# EAGLE design telemetry_controller (EAGLE 5.06)
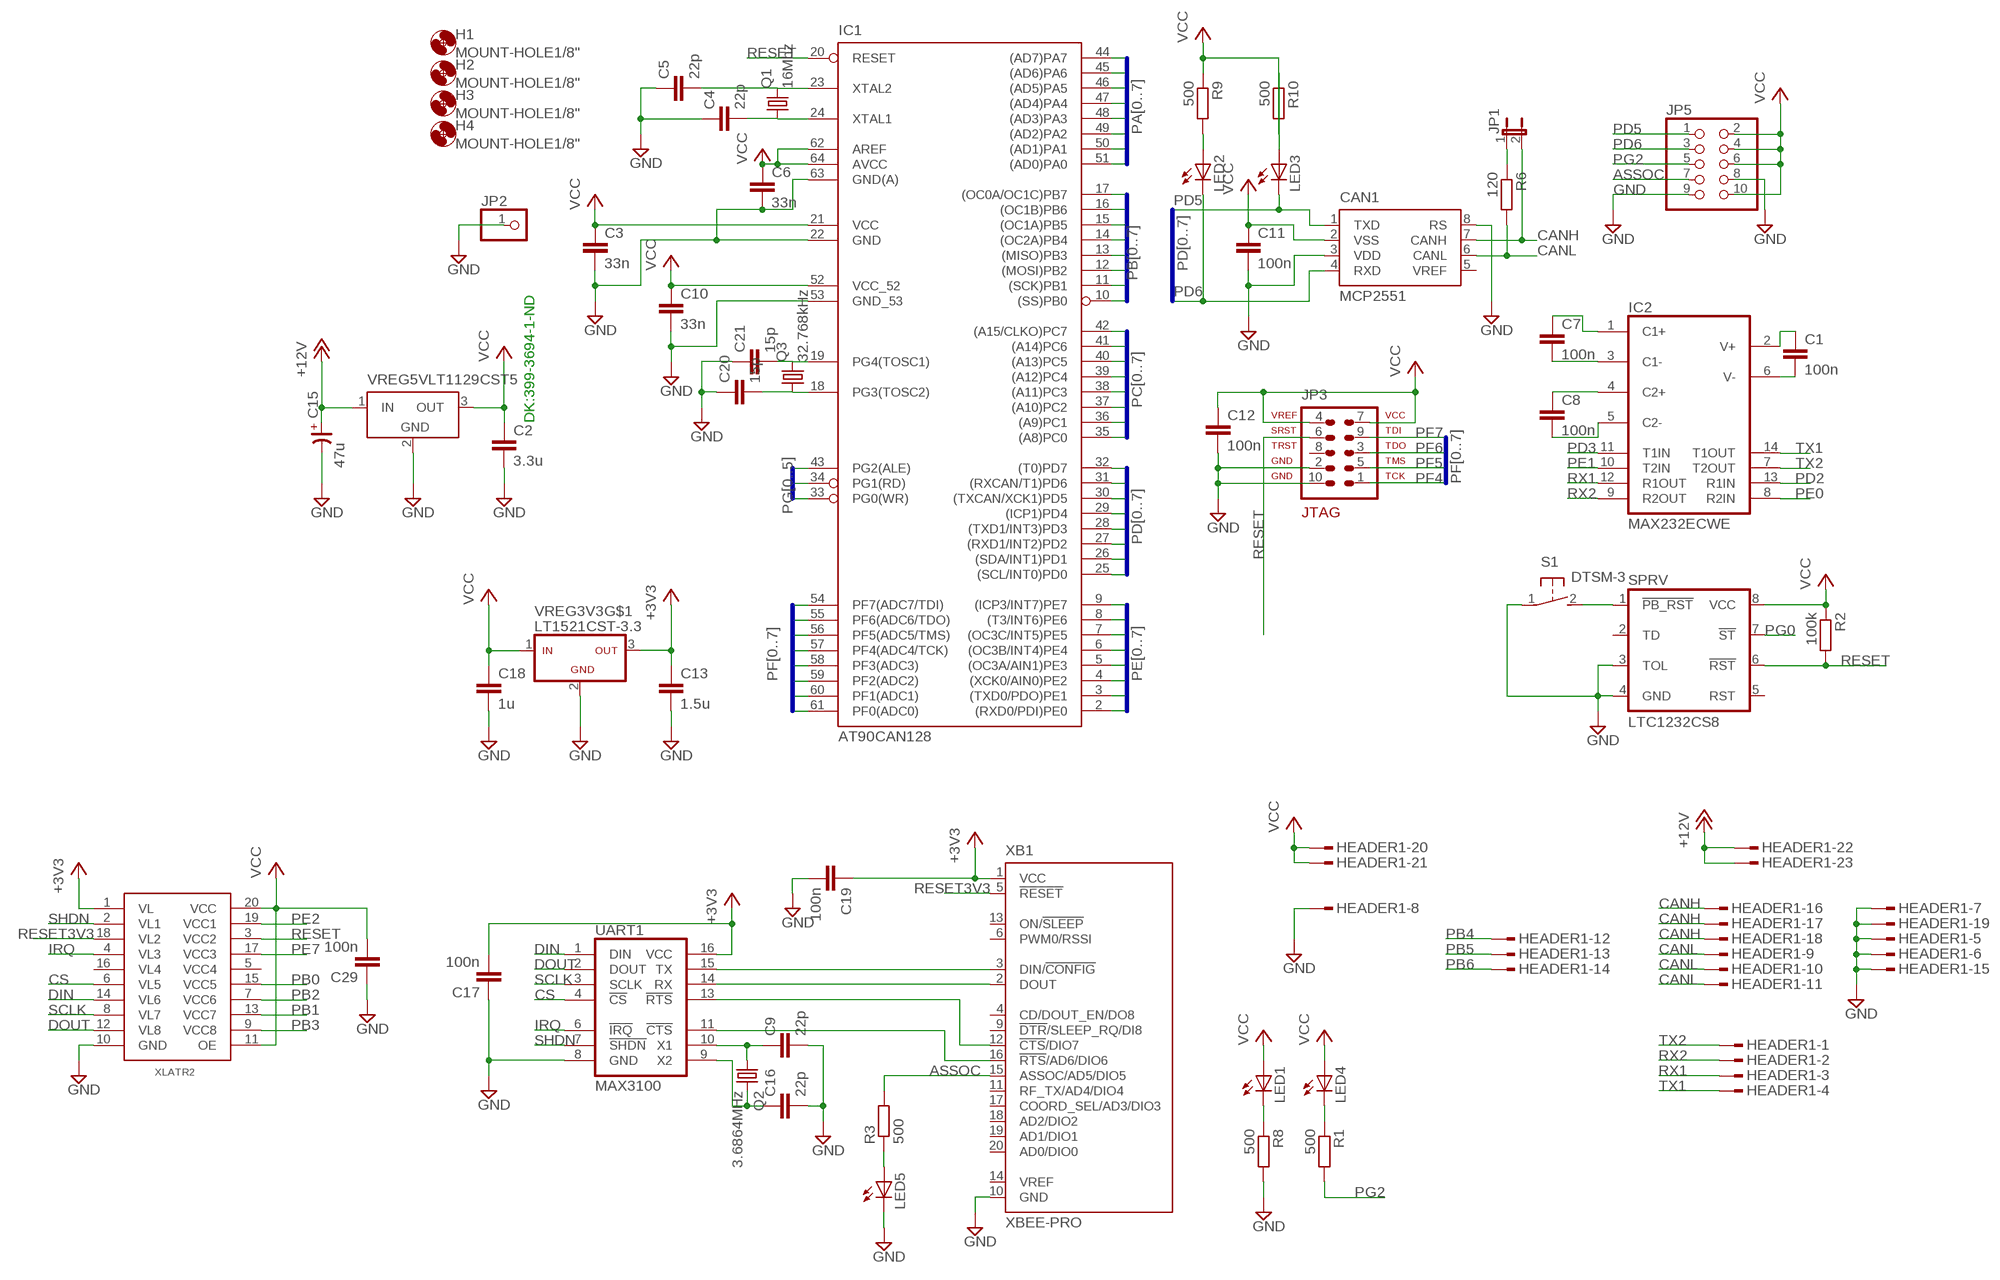
[diagram p0: schematic, sheet 1]

## Parts
C1  100n  C-EUC1206  [C1206]
C2  3.3u  C-EUC1206  [C1206]
C3  33n  C-EUC1206  [C1206]
C4  22p  C-EUC1206  [C1206]
C5  22p  C-EUC1206  [C1206]
C6  33n  C-EUC1206  [C1206]
C7  100n  C-EUC1206  [C1206]
C8  100n  C-EUC1206  [C1206]
C9  22p  C-EUC1206  [C1206]
C10  33n  C-EUC1206  [C1206]
C11  100n  C-EUC1206  [C1206]
C12  100n  C-EUC1206  [C1206]
C13  1.5u  C-EUC1206  [C1206]
C15  47u  CP-SV-E/F  [SV-E/F]
C16  22p  C-EUC1206  [C1206]
C17  100n  C-EUC1206  [C1206]
C18  1u  C-EUC1206  [C1206]
C19  100n  C-EUC1206  [C1206]
C20  15p  C-EUC1206  [C1206]
C21  15p  C-EUC1206  [C1206]
C29  100n  C-EUC1206  [C1206]
CAN1  MCP2551  [SOIC8]
H1  MOUNT-HOLE1/8"  [1/8"]
H2  MOUNT-HOLE1/8"  [1/8"]
H3  MOUNT-HOLE1/8"  [1/8"]
H4  MOUNT-HOLE1/8"  [1/8"]
HEADER1  AMPSEAL23-HEADER  [AMPSEAL23-HEADER]
IC1  AT90CAN128  [TQFP64]
IC2  MAX232ECWE  [SO16L]
JP1  JP1E  [JP1]
JP2  PINHD-1X1  [1X01]
JP3  AVR-JTAG-10  [AVR-JTAG-10]
JP5  PINHD-2X5  [2X05]
LED1  LEDCHIPLED_1206  [CHIPLED_1206]
LED2  LEDCHIPLED_1206  [CHIPLED_1206]
LED3  LEDCHIPLED_1206  [CHIPLED_1206]
LED4  LEDCHIPLED_1206  [CHIPLED_1206]
LED5  LEDCHIPLED_1206  [CHIPLED_1206]
Q1  16Mhz  CRYSTALHC49UP  [HC49UP]
Q2  3.6864MHz  CRYSTALHC49UP  [HC49UP]
Q3  32.768kHz  CRYSTALTC26H  [TC26H]
R1  500  R-EU_R1206  [R1206]
R2  100k  R-EU_R1206  [R1206]
R3  500  R-EU_R1206  [R1206]
R6  120  R-EU_R1206  [R1206]
R8  500  R-EU_R1206  [R1206]
R9  500  R-EU_R1206  [R1206]
R10  500  R-EU_R1206  [R1206]
S1  DTSM-3  [DTSM-3]
SPRV  LTC1232CS8  [SOIC8]
UART1  MAX3100  [QSOP16]
VREG3V3  LT1521CST-3.3  [SOT223]
VREG5V  LT1129CST5  [SOT223]
XB1  XBEE-PRO  [XBEE-PRO]
XLATR2  ST2378E  [TSSOP20]

## Nets
+3V3: C13.1 C17.2 C19.1 UART1.16(VCC) VREG3V3.3(OUT) XB1.1(VCC) XLATR2.1(VL)
+12V: C15.+ HEADER1.22 HEADER1.23 VREG5V.1(IN)
ASSOC: JP5.7 R3.2 XB1.15(ASSOC/AD5/DIO5)
CANH: CAN1.7(CANH) HEADER1.16 HEADER1.17 HEADER1.18 JP1.2
CANL: CAN1.6(CANL) HEADER1.9 HEADER1.10 HEADER1.11 R6.2
CS: UART1.4(!CS) XLATR2.6(VL5)
DIN: UART1.1(DIN) XLATR2.14(VL6)
DOUT: UART1.2(DOUT) XLATR2.12(VL8)
GND: C2.2 C3.2 C4.1 C5.1 C6.2 C9.2 C10.2 C11.2 C12.2 C13.2 C15.- C16.2 C17.1 C18.2 C19.2 C20.1 C21.1 C29.1 CAN1.3(VDD) CAN1.8(RS) HEADER1.5 HEADER1.6 HEADER1.7 HEADER1.8 HEADER1.15 HEADER1.19 IC1.22(GND) IC1.53(GND_53) IC1.63(GND(A)) JP2.1 JP3.2 JP3.10 JP5.8 JP5.9 LED5.C R8.2 S1.1 SPRV.3(TOL) SPRV.4(GND) UART1.8(GND) VREG3V3.2(GND) VREG5V.2(GND) XB1.10(GND) XLATR2.10(GND)
IRQ: UART1.6(!IRQ) XLATR2.4(VL3)
N$1: LED4.C R1.1
N$2: C1.2 IC2.6(V-)
N$3: C1.1 IC2.2(V+)
N$4: C5.2 IC1.23(XTAL2) Q1.2
N$5: C4.2 IC1.24(XTAL1) Q1.1
N$6: C7.1 IC2.1(C1+)
N$7: C7.2 IC2.3(C1-)
N$8: C8.1 IC2.4(C2+)
N$9: C8.2 IC2.5(C2-)
N$10: C9.1 Q2.1 UART1.10(X1)
N$11: LED5.A R3.1
N$12: UART1.11(!CTS) XB1.16(!RTS!/AD6/DIO6)
N$13: C16.1 Q2.2 UART1.9(X2)
N$14: UART1.15(TX) XB1.3(DIN/!CONFIG)
N$15: UART1.14(RX) XB1.2(DOUT)
N$16: UART1.13(!RTS) XB1.12(!CTS!/DIO7)
N$18: S1.2 SPRV.1(!PB_RST)
N$19: JP1.1 R6.1
N$20: LED1.C R8.1
N$21: LED2.A R9.2
N$23: LED3.A R10.1
PA0: IC1.51((AD0)PA0)
PA1: IC1.50((AD1)PA1)
PA2: IC1.49((AD2)PA2)
PA3: IC1.48((AD3)PA3)
PA4: IC1.47((AD4)PA4)
PA5: IC1.46((AD5)PA5)
PA6: IC1.45((AD6)PA6)
PA7: IC1.44((AD7)PA7)
PB0: IC1.10((SS)PB0) XLATR2.15(VCC5)
PB1: IC1.11((SCK)PB1) XLATR2.13(VCC7)
PB2: IC1.12((MOSI)PB2) XLATR2.7(VCC6)
PB3: IC1.13((MISO)PB3) XLATR2.9(VCC8)
PB4: HEADER1.12 IC1.14((OC2A)PB4)
PB5: HEADER1.13 IC1.15((OC1A)PB5)
PB6: HEADER1.14 IC1.16((OC1B)PB6)
PB7: IC1.17((OC0A/OC1C)PB7)
PC0: IC1.35((A8)PC0)
PC1: IC1.36((A9)PC1)
PC2: IC1.37((A10)PC2)
PC3: IC1.38((A11)PC3)
PC4: IC1.39((A12)PC4)
PC5: IC1.40((A13)PC5)
PC6: IC1.41((A14)PC6)
PC7: IC1.42((A15/CLKO)PC7)
PD0: IC1.25((SCL/INT0)PD0)
PD1: IC1.26((SDA/INT1)PD1)
PD2: IC1.27((RXD1/INT2)PD2) IC2.13(R1IN)
PD3: IC1.28((TXD1/INT3)PD3) IC2.11(T1IN)
PD4: IC1.29((ICP1)PD4)
PD5: CAN1.1(TXD) IC1.30((TXCAN/XCK1)PD5) JP5.1 LED3.C
PD6: CAN1.4(RXD) IC1.31((RXCAN/T1)PD6) JP5.3 LED2.C
PD7: IC1.32((T0)PD7)
PE0: IC1.2((RXD0/PDI)PE0) IC2.8(R2IN)
PE1: IC1.3((TXD0/PDO)PE1) IC2.10(T2IN)
PE2: IC1.4((XCK0/AIN0)PE2) XLATR2.19(VCC1)
PE3: IC1.5((OC3A/AIN1)PE3)
PE4: IC1.6((OC3B/INT4)PE4)
PE5: IC1.7((OC3C/INT5)PE5)
PE6: IC1.8((T3/INT6)PE6)
PE7: IC1.9((ICP3/INT7)PE7) XLATR2.17(VCC3)
PF0: IC1.61(PF0(ADC0))
PF1: IC1.60(PF1(ADC1))
PF2: IC1.59(PF2(ADC2))
PF3: IC1.58(PF3(ADC3))
PF4: IC1.57(PF4(ADC4/TCK)) JP3.1
PF5: IC1.56(PF5(ADC5/TMS)) JP3.5
PF6: IC1.55(PF6(ADC6/TDO)) JP3.3
PF7: IC1.54(PF7(ADC7/TDI)) JP3.9
PG0: IC1.33(PG0(WR)) SPRV.7(!ST)
PG1: IC1.34(PG1(RD))
PG2: IC1.43(PG2(ALE)) JP5.5 R1.2
PG3: C20.2 IC1.18(PG3(TOSC2)) Q3.1
PG4: C21.2 IC1.19(PG4(TOSC1)) Q3.2
RESET: IC1.20(RESET) JP3.6 R2.2 SPRV.6(!RST) XLATR2.3(VCC2)
RESET3V3: XB1.5(!RESET) XLATR2.18(VL2)
RX1: HEADER1.3 IC2.12(R1OUT)
RX2: HEADER1.2 IC2.9(R2OUT)
SCLK: UART1.3(SCLK) XLATR2.8(VL7)
SHDN: UART1.7(!SHDN) XLATR2.2(VL1)
TX1: HEADER1.4 IC2.14(T1OUT)
TX2: HEADER1.1 IC2.7(T2OUT)
VCC: C2.1 C3.1 C6.1 C10.1 C11.1 C12.1 C18.1 C29.2 CAN1.2(VSS) HEADER1.20 HEADER1.21 IC1.21(VCC) IC1.52(VCC_52) IC1.62(AREF) IC1.64(AVCC) JP3.4 JP3.7 JP5.2 JP5.4 JP5.6 JP5.10 LED1.A LED4.A R2.1 R9.1 R10.2 SPRV.8(VCC) VREG3V3.1(IN) VREG5V.3(OUT) XLATR2.11(OE) XLATR2.20(VCC)
Unconnected: JP3.8 SPRV.2(TD) SPRV.5(RST) XB1.4(CD/DOUT_EN/DO8) XB1.6(PWM0/RSSI) XB1.9(!DTR!/SLEEP_RQ/DI8) XB1.11(RF_TX/AD4/DIO4) XB1.13(ON/!SLEEP) XB1.14(VREF) XB1.17(COORD_SEL/AD3/DIO3) XB1.18(AD2/DIO2) XB1.19(AD1/DIO1) XB1.20(AD0/DIO0) XLATR2.5(VCC4) XLATR2.16(VL4)

## Buses
PD[0..7]
PF[0..7]
PE[0..7]
PB[0..7]
PA[0..7]
PC[0..7]
PG[0..5]

## Notes on the sheet
- DK:399-3694-1-ND

## Power pins joined to a net without a drawn wire
GND: IC2.15(GND) VREG3V3.4(GND) VREG5V.4(GND)
VCC: IC2.16(VCC)
VREF: CAN1.5(VREF)

## Library data of the parts
C1-C13 C16-C21 C29 = resistor:C-EU: CAPACITOR, European symbol
C15 = cap-master:CP-: POLARIZED CAP
CAN1 = MCP2551:MCP2551
H1-H4 = holes:MOUNT-HOLE: MOUNTING HOLE with drill center marker
HEADER1 = ampseal:AMPSEAL23-HEADER: HEADER ASSEMBLY, 23 POSITION, SNAP-IN, AMPSEAL
IC1 = at90can128:AT90CAN128
IC2 = maxim:MAX232ECWE: RS232 TRANSEIVER
JP1 = jumper:JP1E: JUMPER
JP2 = pinhead:PINHD-1X1: PIN HEADER
JP3 = atmel:AVR-JTAG-10: AVR JTAG Debug/Programming Header
JP5 = pinhead:PINHD-2X5: PIN HEADER
LED1-LED5 = led:LED: LED OSRAM: - CHIPLED LG R971, LG N971, LY N971, LG Q971, LY Q971, LO R971, LY R971 LH N974, LH R974 LS Q976, LO Q976, LY Q976 LO Q996 - Hyper CHIPLED LW Q18S LB Q993, LB Q99A, LB R99A - SideLED LS A670, LO A670, LY A670, LG A670, LP A670 LB A673, LV A673, LT A673, LW A673 LH A674 LY A675 LS A676, LA A676, LO A676, LY A676, LW A676 LS A679, LY A679, LG A679 - Hyper Micro SIDELED® LS Y876, LA Y876, LO Y876, LY Y876 LT Y87S - SmartLED LW L88C, LW L88S LB L89C, LB L89S, LG L890 LS L89K, LO L89K, LY L89K LS L896, LA L896, LO L896, LY L896 - TOPLED LS T670, LO T670, LY T670, LG T670, LP T670 LSG T670, LSP T670, LSY T670, LOP T670, LYG T670 LG T671, LOG T671, LSG T671 LB T673, LV T673, LT T673, LW T673 LH T674 LS T676, LA T676, LO T676, LY T676, LB T676, LH T676, LSB T676, LW T676 LB T67C, LV T67C, LT T67C, LS T67K, LO T67K, LY T67K, LW E67C LS E67B, LA E67B, LO E67B, LY E67B, LB E67C, LV E67C, LT E67C LW T67C LS T679, LY T679, LG T679 LS T770, LO T770, LY T770, LG T770, LP T770 LB T773, LV T773, LT T773, LW T773 LH T774 LS E675, LA E675, LY E675, LS T675 LS T776, LA T776, LO T776, LY T776, LB T776 LHGB T686 LT T68C, LB T68C - Hyper Mini TOPLED® LB M676 - Mini TOPLED Santana® LG M470 LS M47K, LO M47K, LY M47K Source: http://www.osram.convergy.de LUXEON: - LUMILED® LXK2-PW12-R00, LXK2-PW12-S00, LXK2-PW14-U00, LXK2-PW14-V00 LXK2-PM12-R00, LXK2-PM12-S00, LXK2-PM14-U00 LXK2-PE12-Q00, LXK2-PE12-R00, LXK2-PE12-S00, LXK2-PE14-T00, LXK2-PE14-U00 LXK2-PB12-K00, LXK2-PB12-L00, LXK2-PB12-M00, LXK2-PB14-N00, LXK2-PB14-P00, LXK2-PB14-Q00 LXK2-PR12-L00, LXK2-PR12-M00, LXK2-PR14-Q00, LXK2-PR14-R00 LXK2-PD12-Q00, LXK2-PD12-R00, LXK2-PD12-S00 LXK2-PH12-R00, LXK2-PH12-S00 LXK2-PL12-P00, LXK2-PL12-Q00, LXK2-PL12-R00 Source: www.luxeon.com KINGBRIGHT: KA-3528ASYC Source: www.kingbright.com
Q1-Q3 = crystal:CRYSTAL: CRYSTAL
R1-R3 R6 R8-R10 = resistor:R-EU_: RESISTOR, European symbol
S1 = switch-tact:DTSM-3
SPRV = linear:LTC1232: Microprocessor Supervisory Circuit
UART1 = maxim:MAX3100: SPI/Microwire-Compatible UART
VREG3V3 = linear-technology-2:LT1521: 300mA Low Dropout Regulators with Micropower Quiescent Current
VREG5V = linear-technology:LT1129CST5: VOLTAGE REGULATOR with shutdown
XB1 = maxstream:XBEE: XBee (TM) /XBee-PRO(TM) OEM RF Modules Source: MaxStream, Inc. xbee_productmanual.pdf
XLATR2 = stmicro_extra_lib:ST2378E

## Board
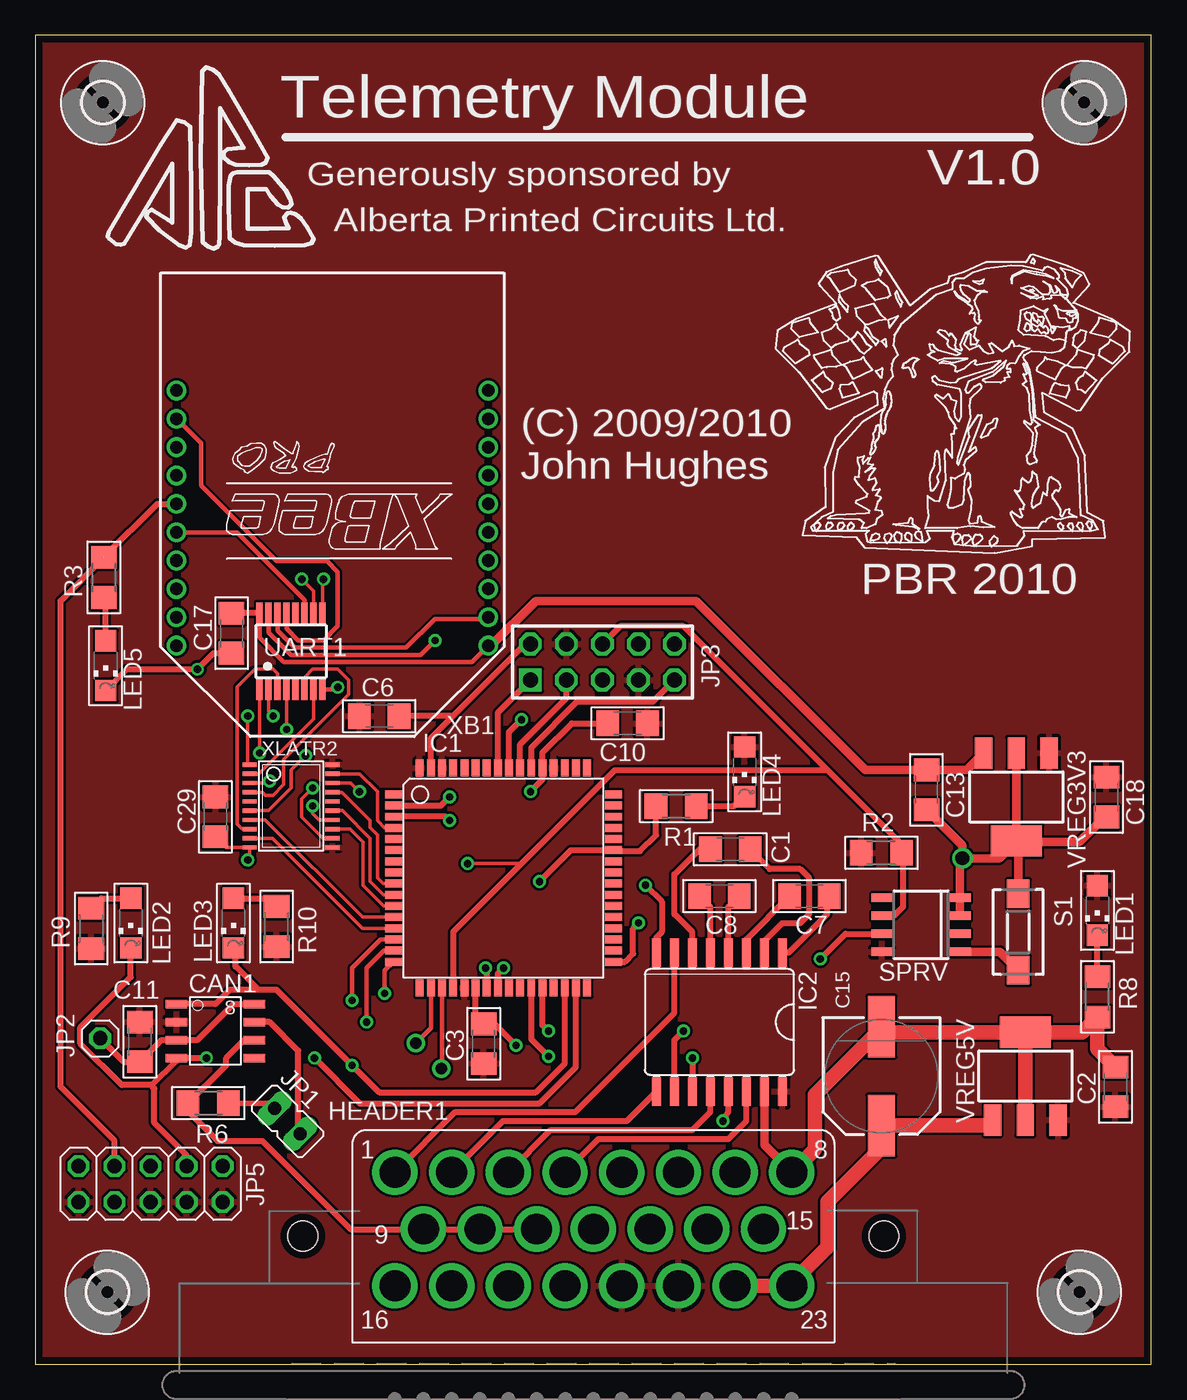
[diagram p1: board, top side]
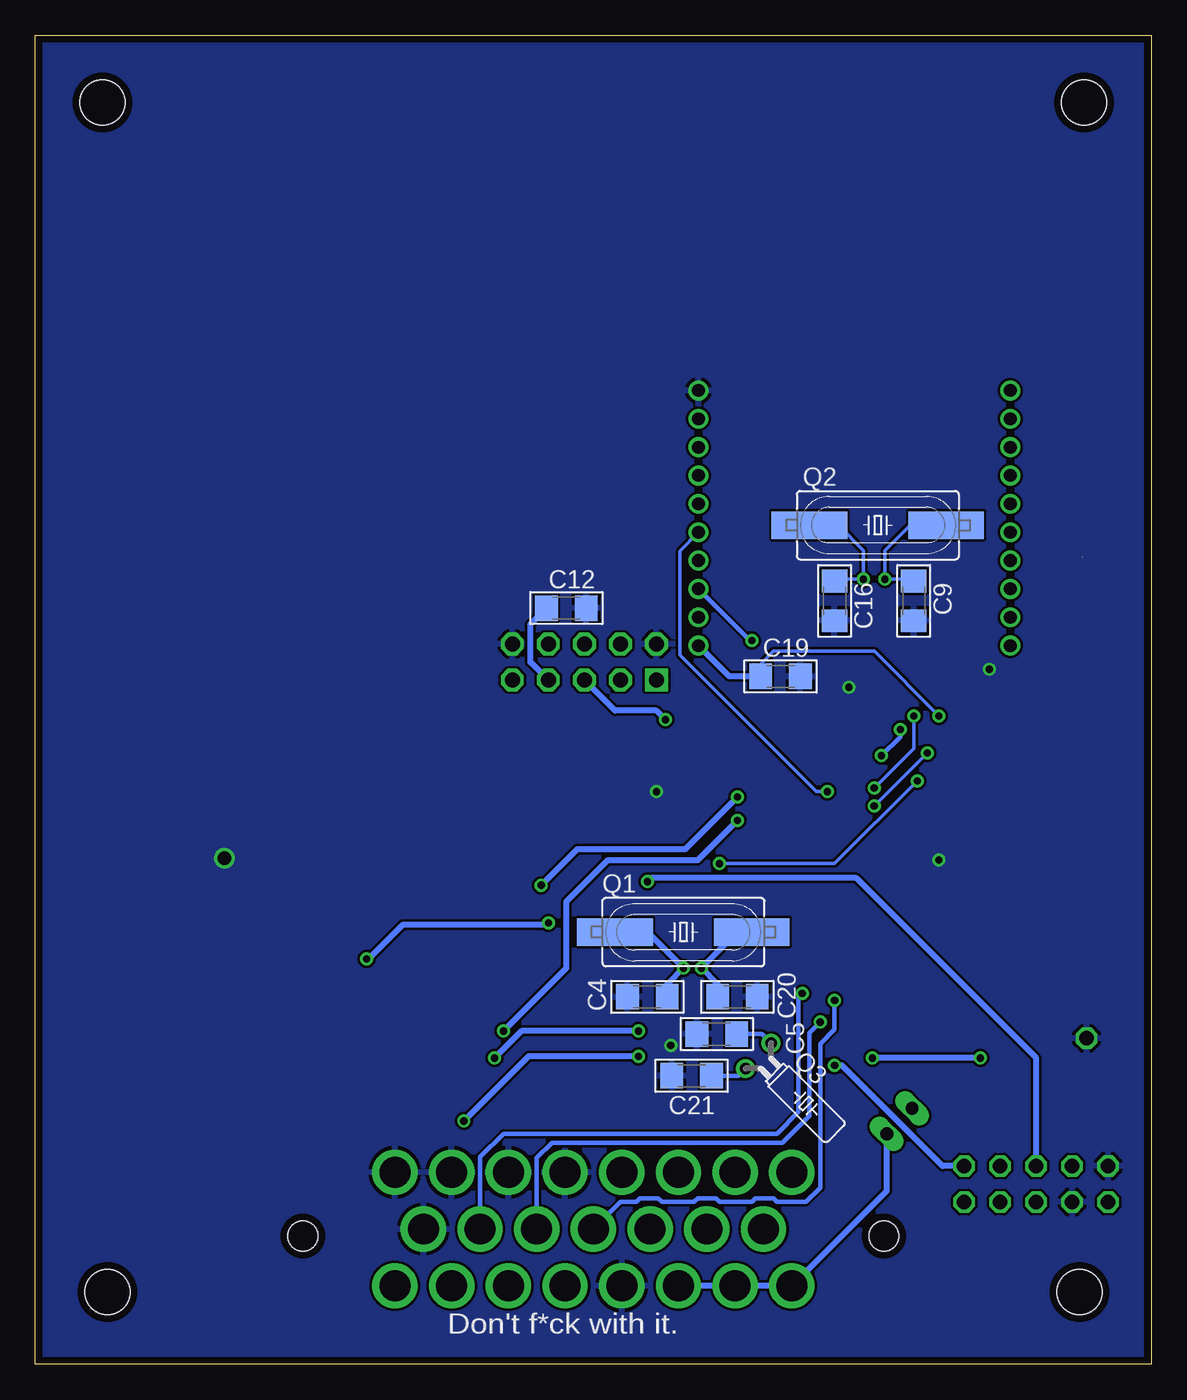
[diagram p2: board, bottom side, seen from below]

Size 78.74 x 93.74 mm. Coordinates in mm from the lower left corner, seen from the top.
Outline: 0,0 78.74,0 78.74,93.74 0,93.74 0,0
Copper layers (1*16): Top 0.035mm / dielectric 1.5mm / Bottom 0.035mm
Design rules "APCircuits": minimum track width 7mil, minimum drill 16mil, track to track 7mil, track to pad 7mil, pad to pad 7mil, via to via 7mil, smd to smd 7mil, copper to edge 20mil, drill to drill 7mil, minimum pad ring 10mil, minimum via ring 8mil, stop-mask expansion 4mil, vias tented up to drill 0mil, thermal gap 10mil

### Footprints (pad centres in the part's own frame; a part is rotated, then mirrored left to right if it is on the bottom)
C1206 = smd 1.6 x 1.8: 1 -1.4,0; 2 1.4,0
SV-E/F = smd 4.318 x 1.93: + -3.493,0; - 3.493,0
SOIC8 = smd 0.61 x 1.524: 1 -2.54,-2.743; 2 -1.27,-2.743; 3 0,-2.743; 4 1.27,-2.743; 5 1.27,2.743; 6 0,2.743; 7 -1.27,2.743; 8 -2.54,2.743
1/8" = hole 3.175: 0,0
AMPSEAL23-HEADER = drill 2.184 round: 1 -14,4; 2 -10,4; 3 -6,4; 4 -2,4; 5 2,4; 6 6,4; 7 10,4; 8 14,4; 9 -12,0; 10 -8,0; 11 -4,0; 12 0,0; 13 4,0; 14 8,0; 15 12,0; 16 -14,-4; 17 -10,-4; 18 -6,-4; 19 -2,-4; 20 2,-4; 21 6,-4; 22 10,-4; 23 14,-4 | hole 2.108: -20.5,-0.5; 20.5,-0.5
TQFP64 = smd 1.194 x 0.559: 1 -7.76,5.905; 2 -7.76,5.118; 3 -7.76,4.331; 4 -7.76,3.543; 5 -7.76,2.756; 6 -7.76,1.968; 7 -7.76,1.181; 8 -7.76,0.394; 9 -7.76,-0.394; 10 -7.76,-1.181; 11 -7.76,-1.968; 12 -7.76,-2.756; 13 -7.76,-3.543; 14 -7.76,-4.331; 15 -7.76,-5.118; 16 -7.76,-5.905; 33 7.76,-5.905; 34 7.76,-5.118; 35 7.76,-4.331; 36 7.76,-3.543; 37 7.76,-2.756; 38 7.76,-1.968; 39 7.76,-1.181; 40 7.76,-0.394; 41 7.76,0.394; 42 7.76,1.181; 43 7.76,1.968; 44 7.76,2.756; 45 7.76,3.543; 46 7.76,4.331; 47 7.76,5.118; 48 7.76,5.905 | smd 0.559 x 1.194: 17 -5.905,-7.76; 18 -5.118,-7.76; 19 -4.331,-7.76; 20 -3.543,-7.76; 21 -2.756,-7.76; 22 -1.968,-7.76; 23 -1.181,-7.76; 24 -0.394,-7.76; 25 0.394,-7.76; 26 1.181,-7.76; 27 1.968,-7.76; 28 2.756,-7.76; 29 3.543,-7.76; 30 4.331,-7.76; 31 5.118,-7.76; 32 5.905,-7.76; 49 5.905,7.76; 50 5.118,7.76; 51 4.331,7.76; 52 3.543,7.76; 53 2.756,7.76; 54 1.968,7.76; 55 1.181,7.76; 56 0.394,7.76; 57 -0.394,7.76; 58 -1.181,7.76; 59 -1.968,7.76; 60 -2.756,7.76; 61 -3.543,7.76; 62 -4.331,7.76; 63 -5.118,7.76; 64 -5.905,7.76
SO16L = smd 0.66 x 2.032: 1 -4.445,-4.902; 2 -3.175,-4.902; 3 -1.905,-4.902; 4 -0.635,-4.902; 5 0.635,-4.902; 6 1.905,-4.902; 7 3.175,-4.902; 8 4.445,-4.902; 9 4.445,4.902; 10 3.175,4.902; 11 1.905,4.902; 12 0.635,4.902; 13 -0.635,4.902; 14 -1.905,4.902; 15 -3.175,4.902; 16 -4.445,4.902
JP1 = drill 0.914 long: 1 0,-1.27; 2 0,1.27
1X01 = drill 1.016 octagon: 1 0,0
AVR-JTAG-10 = drill 1.067 square: 1 -5.08,-1.27 | drill 1.067 octagon: 2 -5.08,1.27; 3 -2.54,-1.27; 4 -2.54,1.27; 5 0,-1.27; 6 0,1.27; 7 2.54,-1.27; 8 2.54,1.27; 9 5.08,-1.27; 10 5.08,1.27
2X05 = drill 1.016 octagon: 1 -5.08,-1.27; 2 -5.08,1.27; 3 -2.54,-1.27; 4 -2.54,1.27; 5 0,-1.27; 6 0,1.27; 7 2.54,-1.27; 8 2.54,1.27; 9 5.08,-1.27; 10 5.08,1.27
CHIPLED_1206 = smd 1.5 x 1.5: A 0,-1.75; C 0,1.75
HC49UP = smd 5.334 x 1.93: 1 -4.826,0; 2 4.826,0
TC26H = drill 0.813 round: 1 -1.27,0; 2 1.27,0
R1206 = smd 1.6 x 1.803: 1 -1.422,0; 2 1.422,0
DTSM-3 = smd 2 x 1.6: 1 -2.7,0; 2 2.7,0
SOIC8' = smd 0.6 x 1.5: 1 -1.905,-2.75; 2 -0.635,-2.75; 3 0.635,-2.75; 4 1.905,-2.75; 5 1.905,2.75; 6 0.635,2.75; 7 -0.635,2.75; 8 -1.905,2.75
QSOP16 = smd 0.45 x 1.5: 1 -2.223,-2.69; 2 -1.587,-2.69; 3 -0.953,-2.69; 4 -0.318,-2.69; 5 0.318,-2.69; 6 0.953,-2.69; 7 1.587,-2.69; 8 2.223,-2.69; 9 2.223,2.69; 10 1.587,2.69; 11 0.953,2.69; 12 0.318,2.69; 13 -0.318,2.69; 14 -0.953,2.69; 15 -1.587,2.69; 16 -2.223,2.69
SOT223 = smd 1.219 x 2.235: 1 -2.311,-3.099; 2 0,-3.099; 3 2.311,-3.099 | smd 3.6 x 2.2: 4 0,3.099
XBEE-PRO = drill 0.889 round: 1 -11,9; 2 -11,7; 3 -11,5; 4 -11,3; 5 -11,1; 6 -11,-1; 7 -11,-3; 8 -11,-5; 9 -11,-7; 10 -11,-9; 11 11,-9; 12 11,-7; 13 11,-5; 14 11,-3; 15 11,-1; 16 11,1; 17 11,3; 18 11,5; 19 11,7; 20 11,9
TSSOP20 = smd 0.305 x 0.991: 1 -2.925,-2.918; 2 -2.275,-2.918; 3 -1.625,-2.918; 4 -0.975,-2.918; 5 -0.325,-2.918; 6 0.325,-2.918; 7 0.975,-2.918; 8 1.625,-2.918; 9 2.275,-2.918; 10 2.925,-2.918; 11 2.925,2.918; 12 2.275,2.918; 13 1.625,2.918; 14 0.975,2.918; 15 0.325,2.918; 16 -0.325,2.918; 17 -0.975,2.918; 18 -1.625,2.918; 19 -2.275,2.918; 20 -2.925,2.918

### Placement (x,y rotation side)
C1  49.02,36.32 180 top
C2  76.2,19.56 90 top
C3  31.62,22.61 90 top
C4  35.56,25.91 0 bottom
C5  29.21,25.91 180 bottom
C6  24.26,45.72 0 top
C7  54.61,33.02 180 top
C8  48.26,33.02 180 top
C9  16.76,53.85 270 bottom
C10  41.78,45.21 180 top
C11  7.37,22.73 270 top
C12  41.27,53.34 0 bottom
C13  62.87,40.51 270 top
C15  59.69,20.32 90 top
C16  22.35,53.85 270 bottom
C17  13.84,51.56 90 top
C18  75.56,40.01 270 top
C19  26.16,48.51 0 bottom
C20  30.67,23.28 0 bottom
C21  32.44,20.34 0 bottom
C29  12.7,38.61 90 top
CAN1  12.7,22.86 270 top
H1  5.08,5.08 0 top
H2  73.66,5.08 0 top
H3  74,89 0 top
H4  4.75,89 0 top
HEADER1  39.37,9.53 0 top
IC1  33.02,34.29 0 top
IC2  48.26,24.13 180 top
JP1  17.78,17.14 225 top
JP2  4.57,22.99 90 top
JP3  40.01,49.53 0 top
JP5  8.13,12.7 180 top
LED1  74.93,32 180 top
LED2  6.73,31.11 180 top
LED3  13.97,31.11 180 top
LED4  50.04,41.78 180 top
LED5  4.95,49.28 180 top
Q1  33.02,30.48 0 bottom
Q2  19.3,59.18 180 bottom
Q3  27.74,21.75 225 bottom
R1  45.21,39.37 180 top
R2  59.69,36.07 0 top
R3  4.83,55.5 90 top
R6  12.19,18.41 180 top
R8  74.93,25.91 270 top
R9  3.94,30.73 90 top
R10  17.02,30.86 270 top
S1  69.34,30.48 270 top
SPRV  LTC1232CS8  [SOIC8']  62.48,30.99 90 top
UART1  18.03,50.29 0 top
VREG3V3  69.22,40.01 180 top
VREG5V  69.85,20.32 0 top
XB1  20.95,59.69 180 top
XLATR2  18.03,39.37 270 top

### Tracks (layer width: path | path; a pad name or v marks a point on that pad's centre or on a via)
+3V3  (via drill 0.51)
  Top 0.254: XLATR2.1 14.99,42.42 v14.99,45.72
  Top 0.305: UART1.16 15.81,51.24 17.53,49.53 30.8,49.53 XB1.1
  Top 0.406: UART1.16 13.86,52.98 C17.2
  Top 0.61: VREG3V3.3 65.71,41.91 C13.1 58.54,41.91 46.61,53.85 35.31,53.85 32.15,50.69 XB1.1
  Bottom 0.254: v14.99,45.72 19.56,50.29 26.67,50.29 27.56,49.4 C19.1
  Bottom 0.406: C19.1 29.78,48.51 XB1.1
+12V
  Top 1.016: HEADER1.22 HEADER1.23 53.37,5.75 55.88,8.26 55.88,11.43 59.69,15.24 C15.+ 67.14,16.83 VREG5V.1
ASSOC  (1 unrouted)
  Top 0.406: JP5.7 5.59,15.75 1.78,19.56 1.78,53.85 4.83,56.9 | XB1.15 8.6,60.69 R3.2
CANH
  Top 0.406: CAN1.7 16.51,24.13 18.54,22.1 18.54,16.38 JP1.2
  Bottom 0.406: JP1.2 18.68,12.22 HEADER1.16 HEADER1.17 HEADER1.18
CANL
  Top 0.406: CAN1.6 14.73,22.86 13.46,21.59 13.46,21.08 11.94,19.56 11.91,19.56 R6.2 10.77,17.83 12.85,15.75 16,15.75 22.23,9.53 HEADER1.9 HEADER1.10 HEADER1.11
CS  (via drill 0.51)
  Top 0.254: XLATR2.6 16.44,39.05 18.03,40.64 18.03,41.91 v19.05,42.93 | v17.72,44.77 UART1.4
  Bottom 0.305: v17.72,44.77 17.72,44.26 v19.05,42.93
DIN  (via drill 0.51)
  Top 0.254: XLATR2.14 20.02,38.4 19.56,38.86 v19.56,39.37 | v15.81,43.12 UART1.1
  Bottom 0.254: v15.81,43.12 v19.56,39.37
DOUT  (via drill 0.51)
  Top 0.254: XLATR2.12 20.31,37.09 18.8,38.61 18.8,39.88 v19.56,40.64 | v16.76,45.72 16.45,46.04 UART1.2
  Bottom 0.254: v19.56,40.64 16.76,43.43 v16.76,45.72
GND  (via drill 0.51, 0.97)
  Top 0.254: v14.99,35.56 15.12,35.69 XLATR2.10 13.46,36.45 C29.1
  Top 0.305: UART1.8 21.19,47.6 v21.34,47.75
  Top 0.406: CAN1.8 13.97,25.4 11.43,22.86 CAN1.3 8.89,22.86 C11.2 6.23,21.33 JP2.1 | IC1.22 31.05,24.58 C3.2 32.38,24.01 v33.91,22.48 | C10.2 37.85,45.21 35.78,43.14 IC1.53 35.78,41.24 v34.92,40.39 | JP3.2 34.54,50.8 29.72,45.97 | C17.1 12.57,50.16 v11.43,49.02 6.45,49.02 LED5.C | C6.2 29.46,45.72 29.72,45.97 | IC1.63 27.9,44.16 29.72,45.97
  Top 0.61: v65.41,35.69 65.23,35.52 SPRV.4 SPRV.3 | v65.41,35.69 65.41,36.57 C13.2 | v65.41,35.69 68,35.69 VREG3V3.4 | VREG3V3.4 VREG3V3.2 | IC2.15 51.44,15.46 HEADER1.8 | 59.37,23.5 C15.- | C18.2 75.44,38.6 73.66,36.83 69.29,36.83 VREG3V3.4 | S1.1 69.34,36.78 VREG3V3.4
  Top 1.016: VREG5V.4 VREG5V.2 | VREG5V.4 73.86,23.42 R8.2 74.93,22.23 C2.2 | VREG5V.4 60.08,23.42 C15.- | 59.37,23.5 59.37,23.37 55,19 55,15.15 HEADER1.8
  pour Bottom: 0,0 78.74,0 78.74,93.74 0,93.74
IRQ
  Top 0.254: UART1.6 18.99,48.45 19.56,49.02 21.34,49.02 22.1,48.26 22.1,47.24 17.53,42.67 17.53,40.89 16.76,40.13 16.26,40.13 16.04,40.34 XLATR2.4
N$1
  Top 0.406: R1.1 49.28,39.37 49.94,40.03 LED4.C
N$2
  Top 0.406: IC2.6 46.35,30.48 45.09,31.75 45.09,34.55 46.86,36.32 C1.2
N$3
  Top 0.406: IC2.2 51.44,29.84 52.7,31.11 53.98,31.11 54.61,31.75 54.61,34.29 53.98,34.92 51.82,34.92 C1.1
N$4  (via drill 0.51)
  Top 0.406: IC1.23 31.84,27.85 v31.75,27.94
  Bottom 0.406: Q1.2 29.21,30.48 v31.75,27.94 30.61,26.8 C5.2
N$5  (via drill 0.51)
  Top 0.406: IC1.24 32.63,27.55 v33.02,27.94
  Bottom 0.406: Q1.1 35.56,30.48 v33.02,27.94 34.16,26.8 C4.2
N$6
  Top 0.406: IC2.1 53.16,29.03 55.88,31.75 55.88,32.89 C7.1
N$7
  Top 0.406: IC2.3 50.16,29.98 C7.2
N$8
  Top 0.406: IC2.4 48.9,32.26 C8.1
N$9
  Top 0.406: IC2.5 47.62,32.26 C8.2
N$10  (via drill 0.51)
  Top 0.254: UART1.10 19.62,54.55 v18.8,55.37
  Bottom 0.254: Q2.1 17.02,59.18 18.8,57.4 v18.8,55.37 16.89,55.37 C9.1
N$11
  Top 0.406: LED5.A 4.95,53.95 R3.1
N$12
  Top 0.305: UART1.11 18.99,53.91 14.22,58.67 9.97,58.67 XB1.16
N$13  (via drill 0.51)
  Top 0.254: UART1.9 20.26,55.31 v20.32,55.37
  Bottom 0.254: Q2.2 22.1,59.18 20.32,57.4 v20.32,55.37 22.23,55.37 C16.1
N$14  (via drill 0.51)
  Top 0.305: UART1.15 16.45,51.63 18.03,50.04 27.18,50.04 v28.19,51.05
  Bottom 0.305: v28.19,51.05 28.32,51.05 XB1.3
N$15
  Top 0.305: UART1.14 17.08,51.75 18.29,50.55 26.16,50.55 28.19,52.58 31.84,52.58 XB1.2
N$16
  Top 0.305: UART1.13 17.72,51.88 18.54,51.05 20.32,51.05 21.34,52.07 21.34,55.88 20.57,56.64 17.02,56.64 11.68,61.98 11.68,64.96 XB1.12
N$18
  Top 0.61: SPRV.1 68.04,29.08 S1.2
N$19
  Top 0.406: R6.1 16.52,18.4 JP1.1
N$20
  Top 0.406: R8.1 LED1.C
N$21
  Top 0.406: R9.2 4.65,32.87 LED2.A
N$23
  Top 0.406: R10.1 16.44,32.87 LED3.A
PB0
  Top 0.254: IC1.10 24.55,33.11 23.62,34.04 23.62,37.08 21.66,39.05 XLATR2.15
PB1
  Top 0.254: IC1.11 24.57,32.32 23.11,33.78 23.11,36.83 22.2,37.74 XLATR2.13
PB2
  Top 0.254: XLATR2.7 16.21,38.4 23.08,31.53 IC1.12
PB3
  Top 0.254: XLATR2.9 16.75,37.09 23.1,30.75 IC1.13
PB4  (via drill 0.51)
  Top 0.305: IC1.14 24.37,29.96 22.35,27.94 v22.35,25.65
  Bottom 0.305: v22.35,25.65 22.35,23.62 23.37,22.61 23.37,12.45 24.38,11.43 26.42,11.43 26.67,11.68 27.94,11.68 28.19,11.43 30.48,11.43 30.73,11.68 32,11.68 32.26,11.43 34.54,11.43 34.8,11.68 36.07,11.68 36.32,11.43 37.47,11.43 HEADER1.12
PB5  (via drill 0.51)
  Top 0.305: IC1.15 24.6,29.17 23.37,27.94 v23.37,24.13
  Bottom 0.305: v23.37,24.13 24.13,23.37 24.13,17.53 26.04,15.62 42.29,15.62 43.37,14.54 HEADER1.13
PB6  (via drill 0.51)
  Top 0.305: IC1.16 24.64,27.76 v24.64,26.16
  Bottom 0.305: v24.64,26.16 24.89,25.91 24.89,17.78 26.42,16.26 45.72,16.26 47.37,14.61 HEADER1.14
PD2  (via drill 0.51)
  Top 0.406: IC2.13 48.9,17.78 v48.51,17.14 | IC1.27 34.99,22.92 v36.2,21.72
  Bottom 0.406: v36.2,21.72 43.94,21.72 v48.51,17.14
PD3  (via drill 0.51)
  Top 0.406: v46.35,21.59 IC2.11 | v36.2,23.5 35.78,23.91 IC1.28
  Bottom 0.406: v36.2,23.5 44.45,23.5 v46.35,21.59
PD5  (via drill 0.51)
  Top 0.406: LED3.C 14.12,29.21 14.12,28.04 15.75,26.42 | IC1.30 37.35,21.22 35.31,19.18 24.26,19.18 v22.35,21.08 | v22.35,21.08 22.25,21.08 | CAN1.1 12.7,25.4 13.72,26.42 15.75,26.42 | 15.75,26.42 17.02,26.42 v22.35,21.08
  Bottom 0.406: JP5.1 14.73,13.97 21.84,21.08 v22.35,21.08
PD6  (via drill 0.51)
  Top 0.406: 8.13,19.68 6.1,19.68 3.17,22.61 3.17,23.75 6.73,27.3 LED2.C | 8.13,19.68 8.26,19.68 9.96,21.39 CAN1.4 v12.06,21.59 | IC1.31 38.14,20.96 35.56,18.39 22.89,18.39 v19.68,21.59 | JP5.3 10.67,14.73 8.38,17.02 8.38,19.43 8.13,19.68
  Bottom 0.406: v12.06,21.59 v19.68,21.59
PE0  (via drill 0.51)
  Top 0.406: v29.21,40.01 28.61,39.41 IC1.2 | IC2.8 43.81,30.1 44.2,30.48 44.2,32.64 v43.05,33.78
  Bottom 0.406: v43.05,33.78 40.51,36.32 32.89,36.32 v29.21,40.01
PE1  (via drill 0.51)
  Top 0.406: IC2.10 45.09,22.86 v45.72,23.5 | IC1.3 28.94,38.62 v29.21,38.35
  Bottom 0.406: v45.72,23.5 41.27,27.94 41.27,32.64 38.35,35.56 32,35.56 v29.21,38.35
PE2
  Top 0.254: IC1.4 24.65,37.83 24.13,38.35 24.13,40.39 22.87,41.65 XLATR2.19
PE7
  Top 0.254: IC1.9 24.52,33.9 24.13,34.29 24.13,37.34 23.62,37.85 23.62,38.35 21.63,40.34 XLATR2.17
PF4
  Top 0.406: IC1.57 32.63,45.96 JP3.1
PF5  (via drill 0.51)
  Top 0.406: IC1.56 33.41,44.59 v34.29,45.47
  Bottom 0.406: v34.29,45.47 34.92,46.1 37.85,46.1 JP3.5
PF6
  Top 0.406: IC1.55 34.2,43.73 37.47,46.99 JP3.3
PF7
  Top 0.406: IC1.54 34.99,43.5 38.23,46.74 43.56,46.74 JP3.9
PG0  (via drill 0.51)
  Top 0.406: IC1.33 41.59,28.38 42.16,28.96 42.16,30.73 v42.55,31.11 | SPRV.7 57.15,30.35 v55.37,28.57
  Bottom 0.406: v55.37,28.57 55.24,28.57 52.83,30.99 42.67,30.99 v42.55,31.11
PG2  (via drill 0.51)
  Top 0.406: R1.2 43.79,37.31 42.67,36.2 40.84,36.2 IC1.43 37.78,36.26 v35.56,34.04
  Bottom 0.406: JP5.5 8.13,21.59 20.83,34.29 35.31,34.29 v35.56,34.04
PG3
  Top 0.305: IC1.18 27.9,23.7 Q3.1
  Bottom 0.305: C20.2 27.48,23.28 Q3.1
PG4
  Top 0.305: IC1.19 28.69,20.9 Q3.2
  Bottom 0.305: C21.2 29.15,20.34 Q3.2
RESET  (via drill 0.51)
  Top 0.254: XLATR2.3 16.36,40.99 v16.51,41.15 | v30.48,35.31 34.29,35.31 34.42,35.43
  Top 0.406: JP3.6 41.27,52.07 45.72,52.07 55.88,41.91 | 55.88,41.91 60.96,36.83 60.96,35.71 R2.2 61.21,35.97 61.21,32.26 60.58,31.62 SPRV.6 | IC1.20 29.48,30.49 34.42,35.43 40.89,41.91 55.88,41.91
  Bottom 0.254: v16.51,41.15 22.35,35.31 v30.48,35.31
  Bottom 0.406: JP3.6 39.84,50.8
RESET3V3  (via drill 0.51)
  Top 0.254: XLATR2.18 22.25,40.99 v22.86,40.39
  Bottom 0.254: v22.86,40.39 23.62,40.39 33.27,50.04 33.27,57.37 XB1.5
RX1
  Top 0.406: IC2.12 47.62,17.78 46.35,16.51 36.35,16.51 HEADER1.3
RX2
  Top 0.406: HEADER1.2 32.99,17.14 41.73,17.14 IC2.9
SCLK
  Top 0.254: XLATR2.8 14.58,37.74 14.22,38.1 14.22,47.75 15.49,49.02 16.76,49.02 17.08,48.7 UART1.3
SHDN
  Top 0.254: XLATR2.2 15.74,41.65 19.62,45.53 UART1.7
TX1
  Top 0.406: IC2.14 50.16,17.14 48.9,15.88 39.72,15.88 HEADER1.4
TX2
  Top 0.406: IC2.7 45.09,24.77 38.1,17.78 29.62,17.78 HEADER1.1
VCC
  Bottom 0.406: JP3.7 43.81,49.53 43.81,52.2 C12.1
  pour Top: 0,0 78.74,0 78.74,93.74 0,93.74

### Text on the board
tPlace: Telemetry Module | Generously sponsored by | V1.0 | Alberta Printed Circuits Ltd. | (C) 2009/2010 | John Hughes | PBR 2010
bPlace: Don't f*ck with it.
tDocu: Power | Assoc | Stat | CanRx | CanTx